# EAGLE schematic Select Fire Rapidstrike (EAGLE 9.1.0)

## Sheet 1 of 4
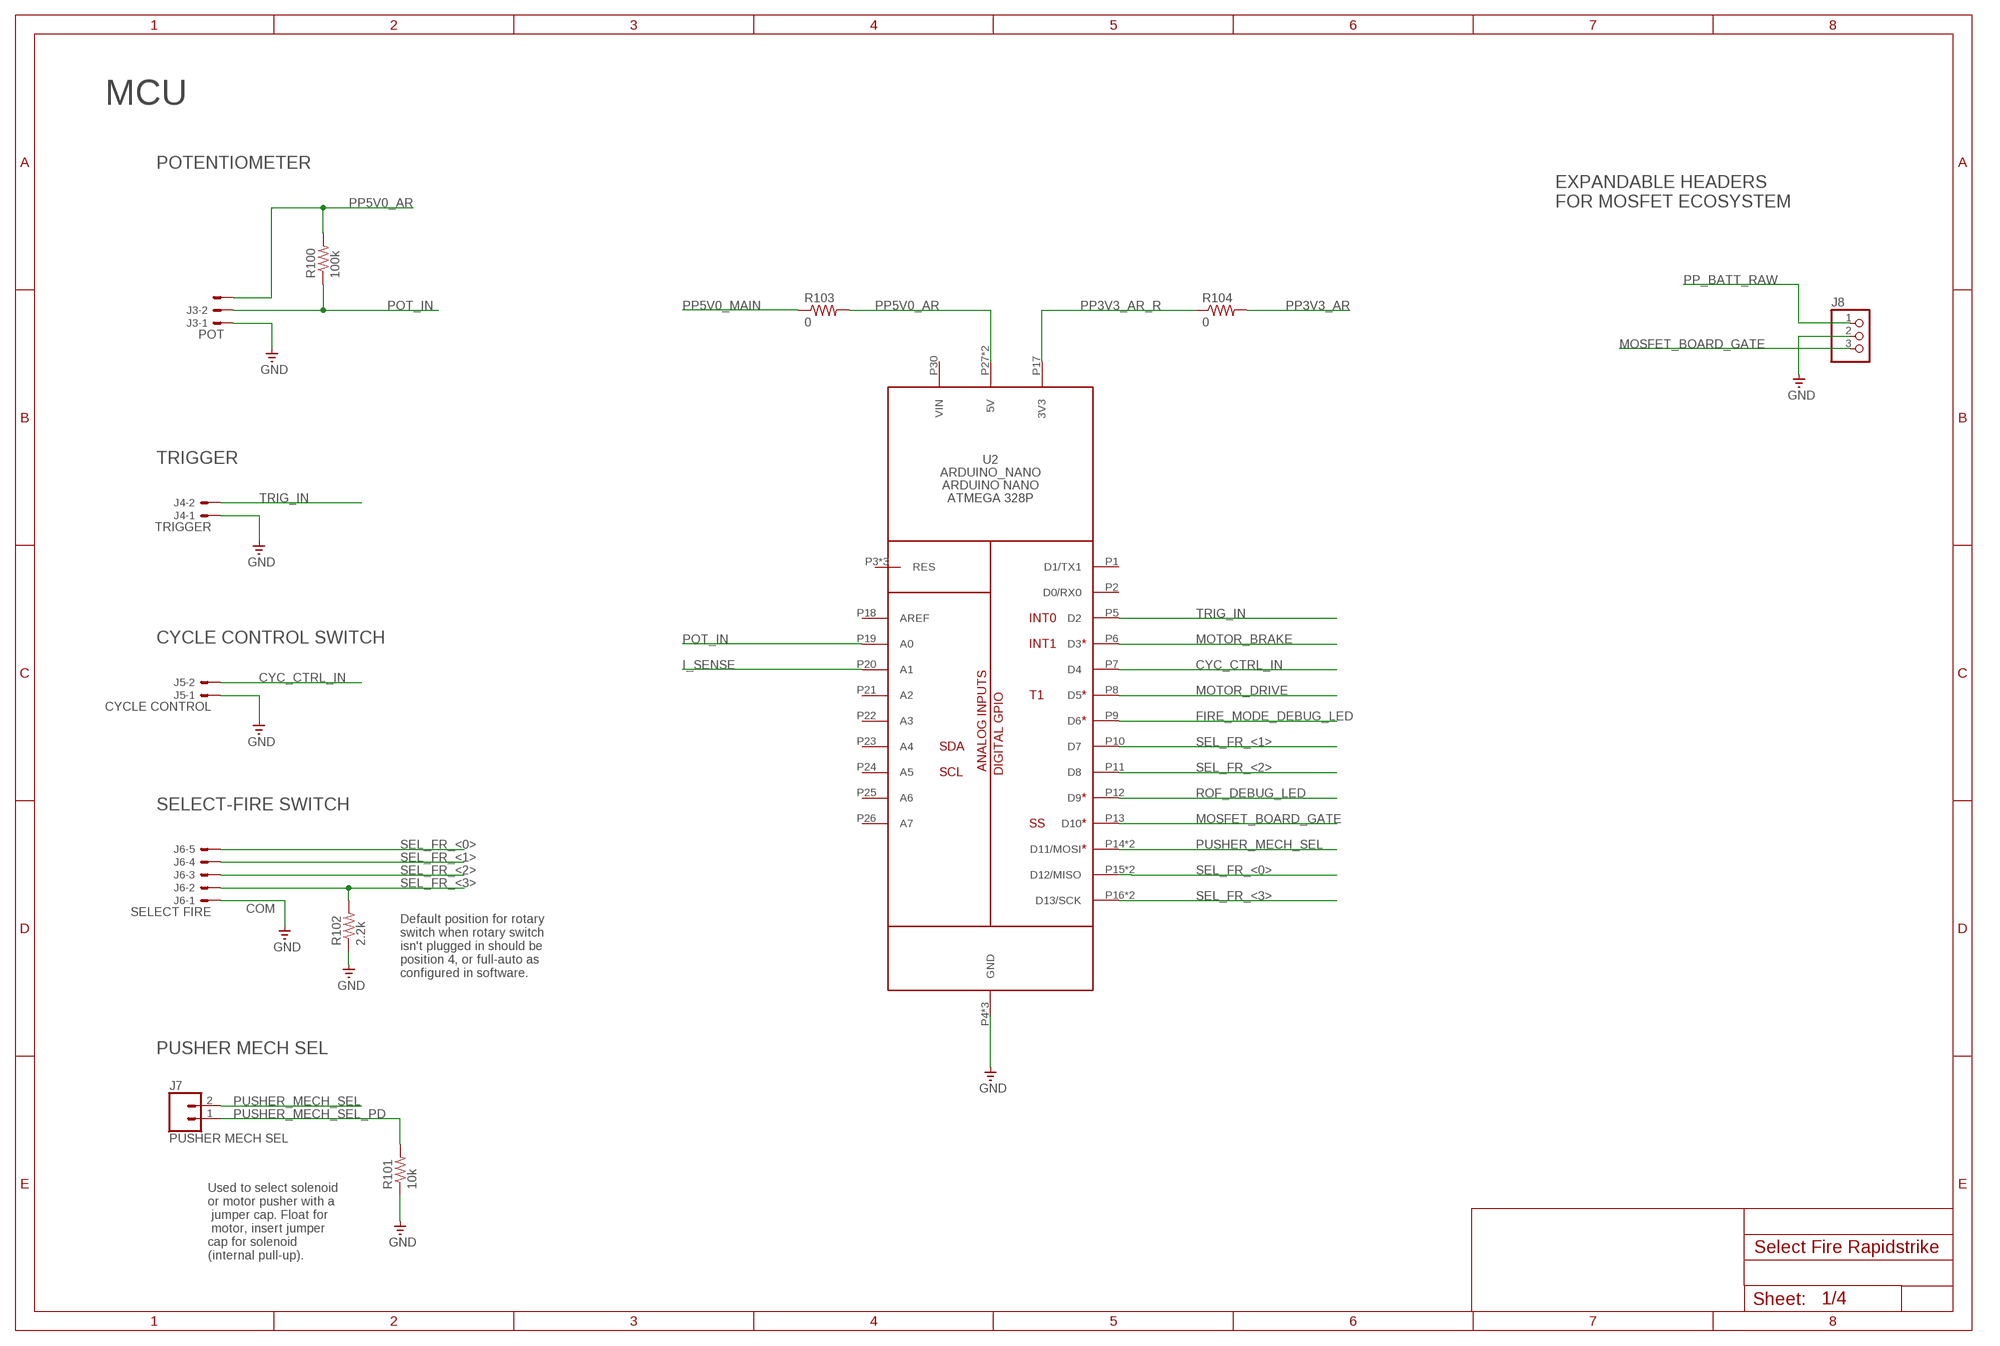
[diagram p0: schematic, sheet 1]

### Parts
J3  POT  JST-XH-03-PIN-LONG-PAD  [JST-XH-03-PACKAGE-LONG-PAD]
J4  TRIGGER  JST-XH-02-PIN-LONG-PAD  [JST-XH-02-PACKAGE-LONG-PAD]
J5  CYCLE CONTROL  JST-XH-02-PIN-LONG-PAD  [JST-XH-02-PACKAGE-LONG-PAD]
J6  SELECT FIRE  JST-XH-05-PIN-LONG-PAD  [JST-XH-05-PACKAGE-LONG-PAD]
J7  PUSHER MECH SEL  CONN_02  [1X02]
J8  PINHD-1X3  [1X03]
R100  100k  R-US_M0805  [M0805]
R101  10k  R-US_M0805  [M0805]
R102  2.2k  R-US_M0805  [M0805]
R103  0  R-US_M0805  [M0805]
R104  0  R-US_M0805  [M0805]
U2  ARDUINO_NANO  [ARDUINO_NANO]

### Nets
CYC_CTRL_IN: J5.2 U2.P7(D4) ; also sheet 4
FIRE_MODE_DEBUG_LED: U2.P9(D6) ; also sheet 4
GND: J3.1 J4.1 J5.1 J6.1 J8.2 R101.1 R102.1 U2.P4(GND) U2.P29(GND) U2.P32(GND) ; also sheet 2,3,4
I_SENSE: U2.P20(A1) ; also sheet 3
MOSFET_BOARD_GATE: J8.3 U2.P13(D10)
MOTOR_BRAKE: U2.P6(D3) ; also sheet 3,4
MOTOR_DRIVE: U2.P8(D5) ; also sheet 3,4
POT_IN: J3.2 R100.1 U2.P19(A0)
PP3V3_AR: R104.2 ; also sheet 2
PP3V3_AR_R: R104.1 U2.P17(3V3)
PP5V0_AR: J3.3 R100.2 R103.2 U2.P27(5V) U2.P36(5V) ; also sheet 2,4
PP5V0_MAIN: R103.1 ; also sheet 2
PP_BATT_RAW: J8.1 ; also sheet 2,3
PUSHER_MECH_SEL: J7.2 U2.P14(D11/MOSI) U2.P34(D11/MOSI)
PUSHER_MECH_SEL_PD: J7.1 R101.2
ROF_DEBUG_LED: U2.P12(D9) ; also sheet 4
SEL_FR_<0>: J6.5 U2.P15(D12/MISO) U2.P35(D12/MISO)
SEL_FR_<1>: J6.4 U2.P10(D7)
SEL_FR_<2>: J6.3 U2.P11(D8)
SEL_FR_<3>: J6.2 R102.2 U2.P16(D13/SCK) U2.P33(D13/SCK)
TRIG_IN: J4.2 U2.P5(D2) ; also sheet 4
Unconnected: U2.P1(D1/TX1) U2.P2(D0/RX0) U2.P3(RES) U2.P18(AREF) U2.P21(A2) U2.P22(A3) U2.P23(A4) U2.P24(A5) U2.P25(A6) U2.P26(A7) U2.P28(RES) U2.P30(VIN) U2.P31(RES)

### Notes on the sheet
- MCU
- POTENTIOMETER
- EXPANDABLE HEADERS 
  FOR MOSFET ECOSYSTEM
- TRIGGER
- CYCLE CONTROL SWITCH
- SELECT-FIRE SWITCH
- COM
- Default position for rotary
  switch when rotary switch 
  isn't plugged in should be 
  position 4, or full-auto as 
  configured in software.
- PUSHER MECH SEL
- Used to select solenoid 
  or motor pusher with a
   jumper cap. Float for
   motor, insert jumper 
  cap for solenoid 
  (internal pull-up).

## Sheet 2 of 4
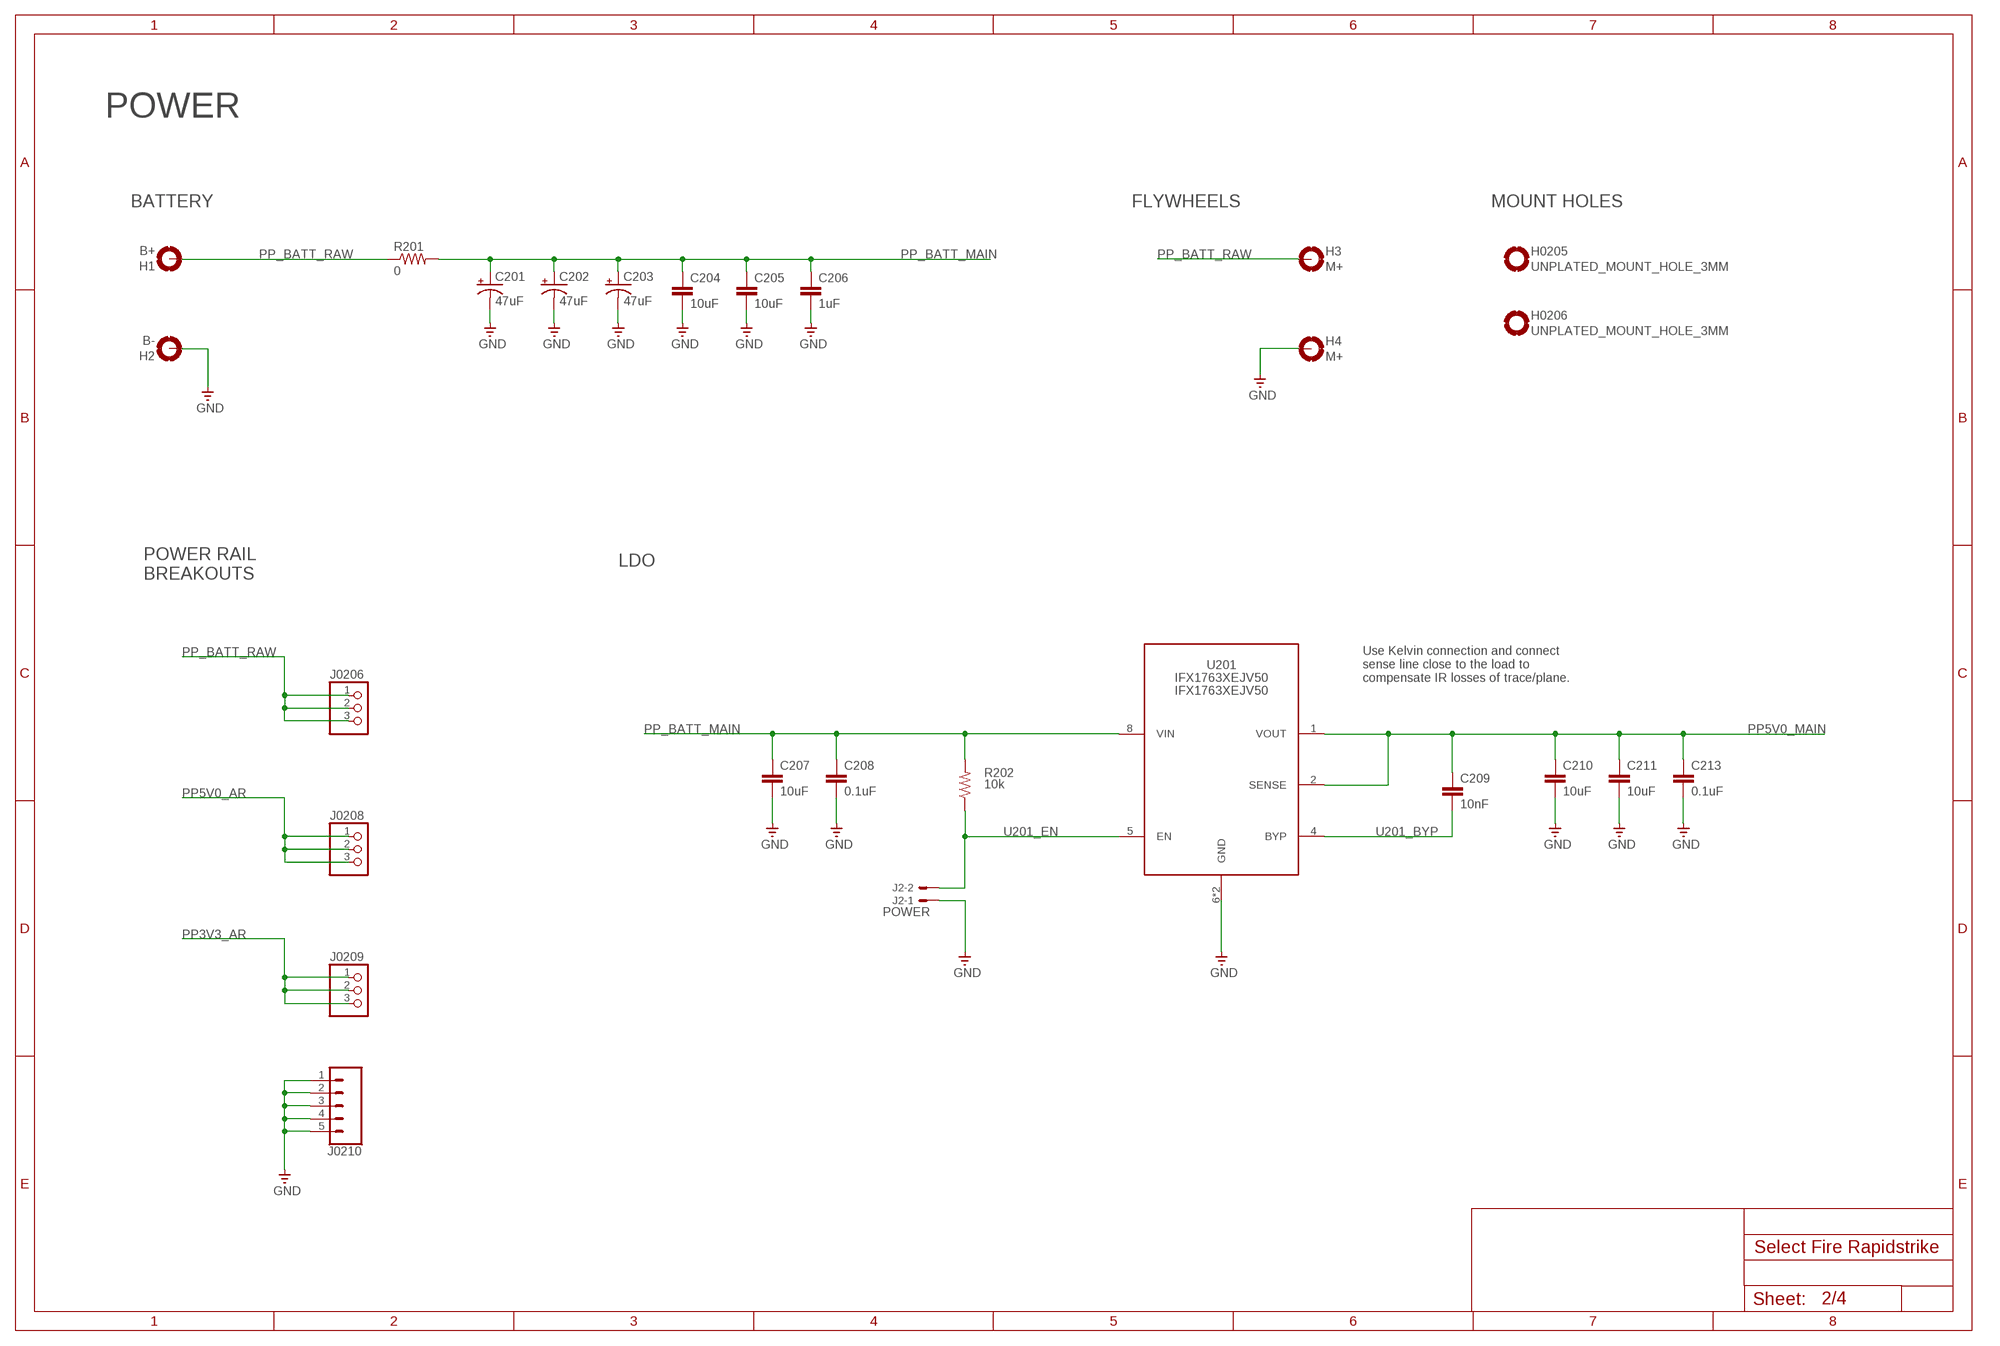
[diagram p1: schematic, sheet 2]

### Parts
C201  47uF  CPOL-USE2-5  [E2-5]
C202  47uF  CPOL-USE2-5  [E2-5]
C203  47uF  CPOL-USE2-5  [E2-5]
C204  10uF  CC1206  [C1206]
C205  10uF  CC1206  [C1206]
C206  1uF  C-EUC0805  [C0805]
C207  10uF  CC1206  [C1206]
C208  0.1uF  C-EUC0805  [C0805]
C209  10nF  C-EUC0805  [C0805]
C210  10uF  CC1206  [C1206]
C211  10uF  CC1206  [C1206]
C213  0.1uF  C-EUC0805  [C0805]
H1  B+  MOUNT-HOLE-2.5MM  [MOUNT-HOLE-2.5MM]
H2  B-  MOUNT-HOLE-2.5MM  [MOUNT-HOLE-2.5MM]
H3  M+  MOUNT-HOLE-2.5MM  [MOUNT-HOLE-2.5MM]
H4  M+  MOUNT-HOLE-2.5MM  [MOUNT-HOLE-2.5MM]
H0205  UNPLATED_MOUNT_HOLE_3MM  [UNPLATED_MOUNT_HOLE_3MM]
H0206  UNPLATED_MOUNT_HOLE_3MM  [UNPLATED_MOUNT_HOLE_3MM]
J2  POWER  JST-XH-02-PIN-LONG-PAD  [JST-XH-02-PACKAGE-LONG-PAD]
J0206  PINHD-1X3  [1X03]
J0208  PINHD-1X3  [1X03]
J0209  PINHD-1X3  [1X03]
J0210  CONN_05  [1X05]
R201  0  R-US_M0805  [M0805]
R202  10k  R-US_M0805  [M0805]
U201  IFX1763XEJV50  [PG-DSO-8]

### Nets
GND: C201.- C202.- C203.- C204.2 C205.2 C206.2 C207.2 C208.2 C210.2 C211.2 C213.2 H2.P$1(MOUNT) H4.P$1(MOUNT) J2.1 J0210.1 J0210.2 J0210.3 J0210.4 J0210.5 U201.6(GND) U201.BODY(GND) ; also sheet 1,3,4
PP3V3_AR: J0209.1 J0209.2 J0209.3 ; also sheet 1
PP5V0_AR: J0208.1 J0208.2 J0208.3 ; also sheet 1,4
PP5V0_MAIN: C209.1 C210.1 C211.1 C213.1 U201.1(VOUT) U201.2(SENSE) ; also sheet 1
PP_BATT_MAIN [BATT_POWER]: C201.+ C202.+ C203.+ C204.1 C205.1 C206.1 C207.1 C208.1 R201.2 R202.2 U201.8(VIN)
PP_BATT_RAW: H1.P$1(MOUNT) H3.P$1(MOUNT) J0206.1 J0206.2 J0206.3 R201.1 ; also sheet 1,3
U201_BYP: C209.2 U201.4(BYP)
U201_EN: J2.2 R202.1 U201.5(EN)

### Notes on the sheet
- POWER
- BATTERY | FLYWHEELS | MOUNT HOLES
- LDO
- POWER RAIL
  BREAKOUTS
- Use Kelvin connection and connect
  sense line close to the load to 
  compensate IR losses of trace/plane.

## Sheet 3 of 4
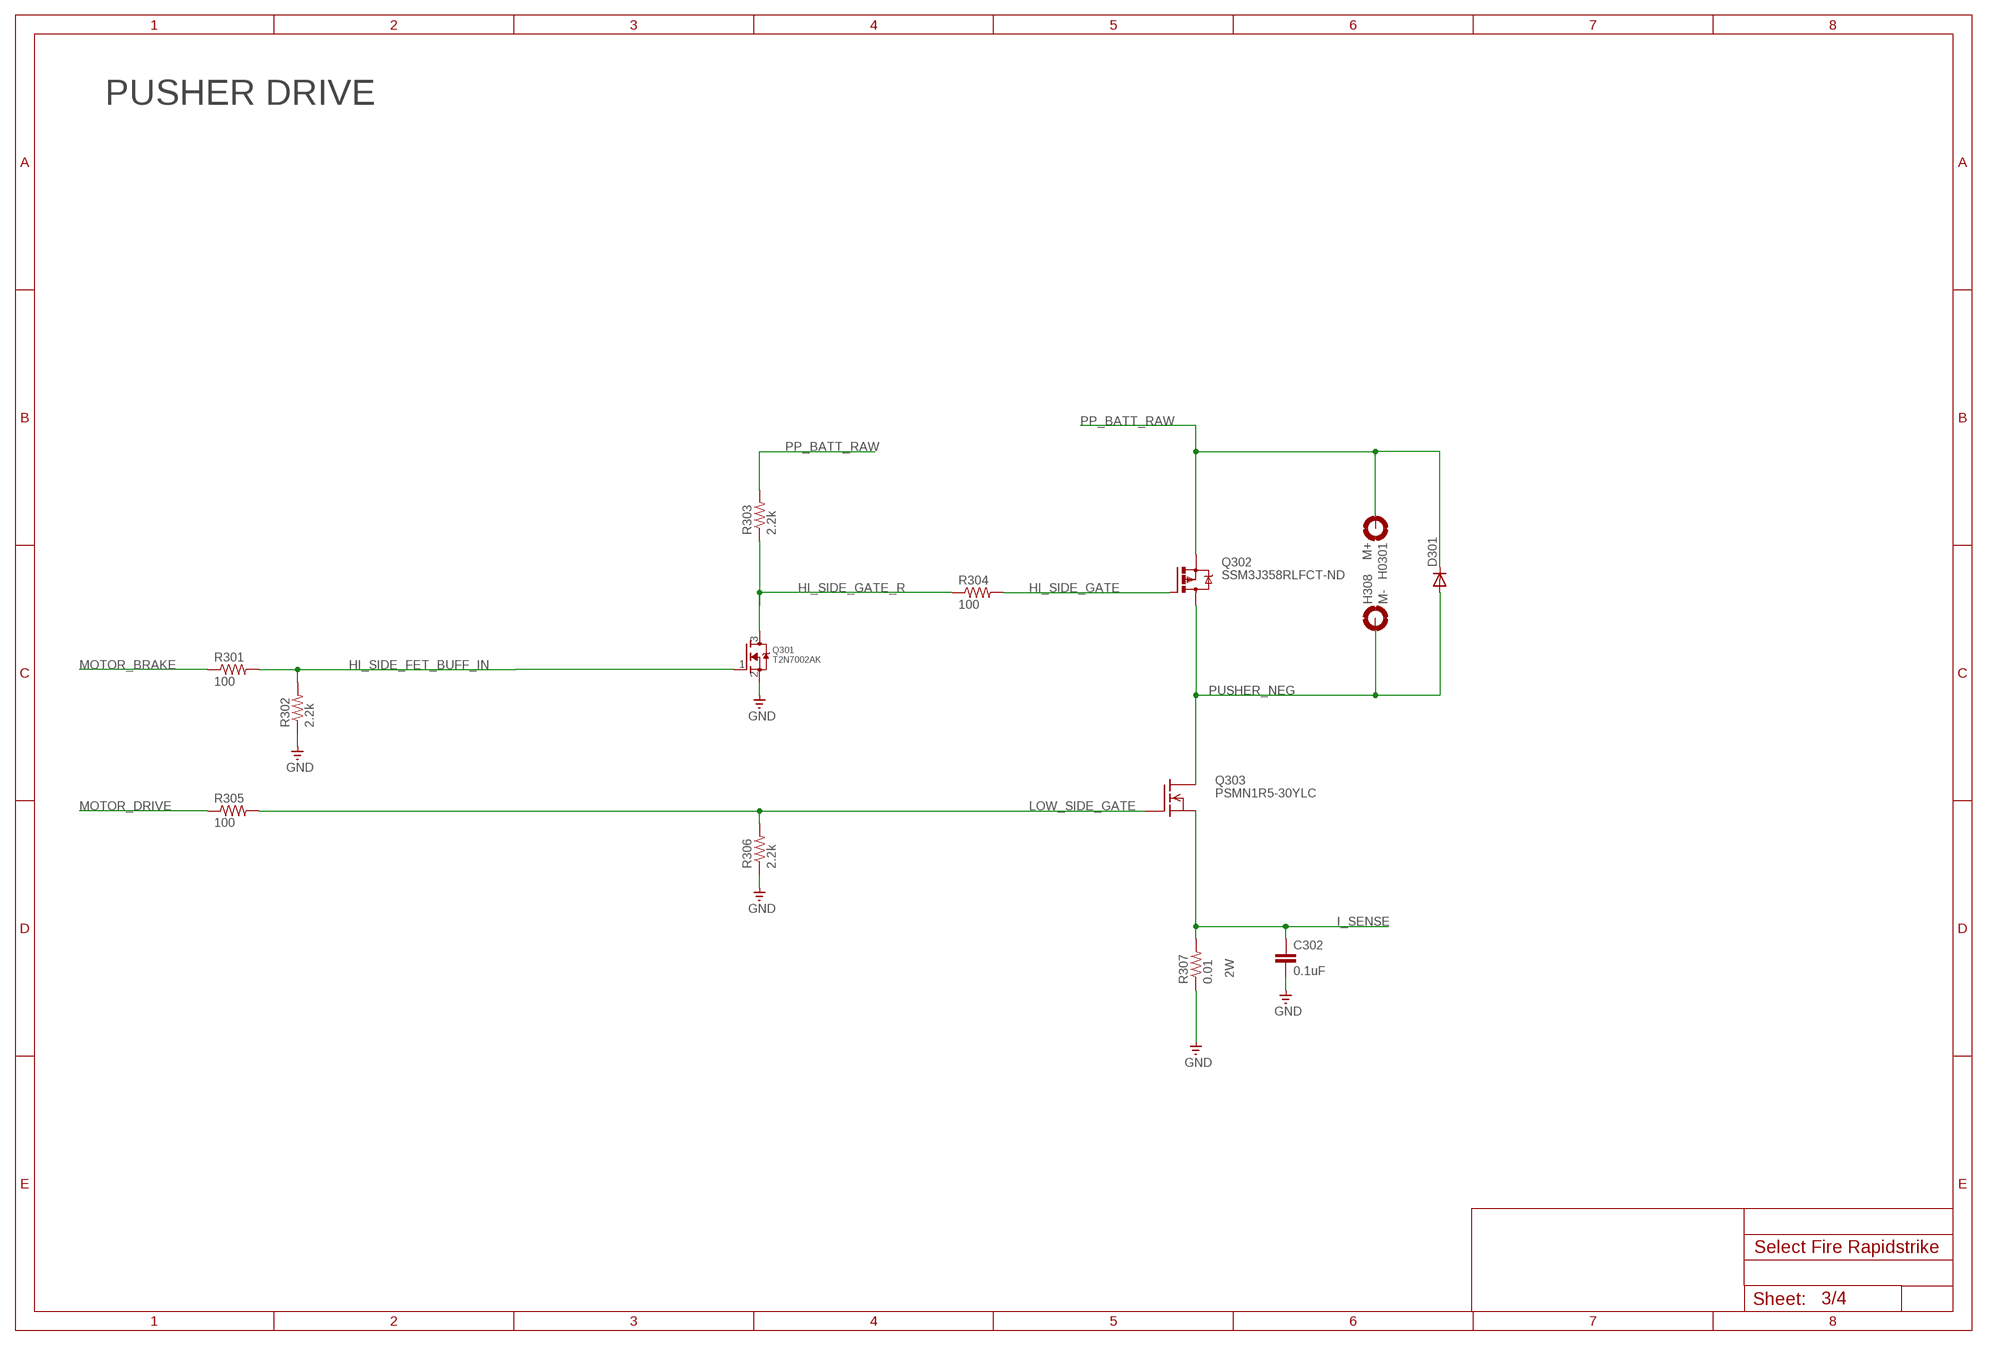
[diagram p2: schematic, sheet 3]

### Parts
C302  0.1uF  C-EUC0805  [C0805]
D301  S2A  [DO214AA]
H0301  M+  MOUNT-HOLE-2.5MM  [MOUNT-HOLE-2.5MM]
H308  M-  MOUNT-HOLE-2.5MM  [MOUNT-HOLE-2.5MM]
Q301  T2N7002AK  MOSFET-NREFLOW  [SOT23]
Q302  SSM3J358RLFCT-ND  MOSFET-P-SOT23  [SOT-23]
Q303  PSMN1R5-30YLC  [TO127P600X120-5N]
R301  100  R-US_M0805  [M0805]
R302  2.2k  R-US_M0805  [M0805]
R303  2.2k  R-US_M0805  [M0805]
R304  100  R-US_M0805  [M0805]
R305  100  R-US_M0805  [M0805]
R306  2.2k  R-US_M0805  [M0805]
R307  0.01  R-US_R2512  [R2512]

### Nets
GND: C302.2 Q301.2(S) R302.1 R306.1 R307.1 ; also sheet 1,2,4
HI_SIDE_FET_BUFF_IN: Q301.1(G) R301.2 R302.2
HI_SIDE_GATE: Q302.1(G) R304.2
HI_SIDE_GATE_R: Q301.3(D) R303.1 R304.1
I_SENSE: C302.1 Q303.1(S) Q303.2(S) Q303.3(S) R307.2 ; also sheet 1
LOW_SIDE_GATE: Q303.4(G) R305.2 R306.2
MOTOR_BRAKE: R301.1 ; also sheet 1,4
MOTOR_DRIVE: R305.1 ; also sheet 1,4
PP_BATT_RAW: D301.C H0301.P$1(MOUNT) Q302.2(S) R303.2 ; also sheet 1,2
PUSHER_NEG: D301.A H308.P$1(MOUNT) Q302.3(D) Q303.5(D)

### Notes on the sheet
- PUSHER DRIVE

## Sheet 4 of 4
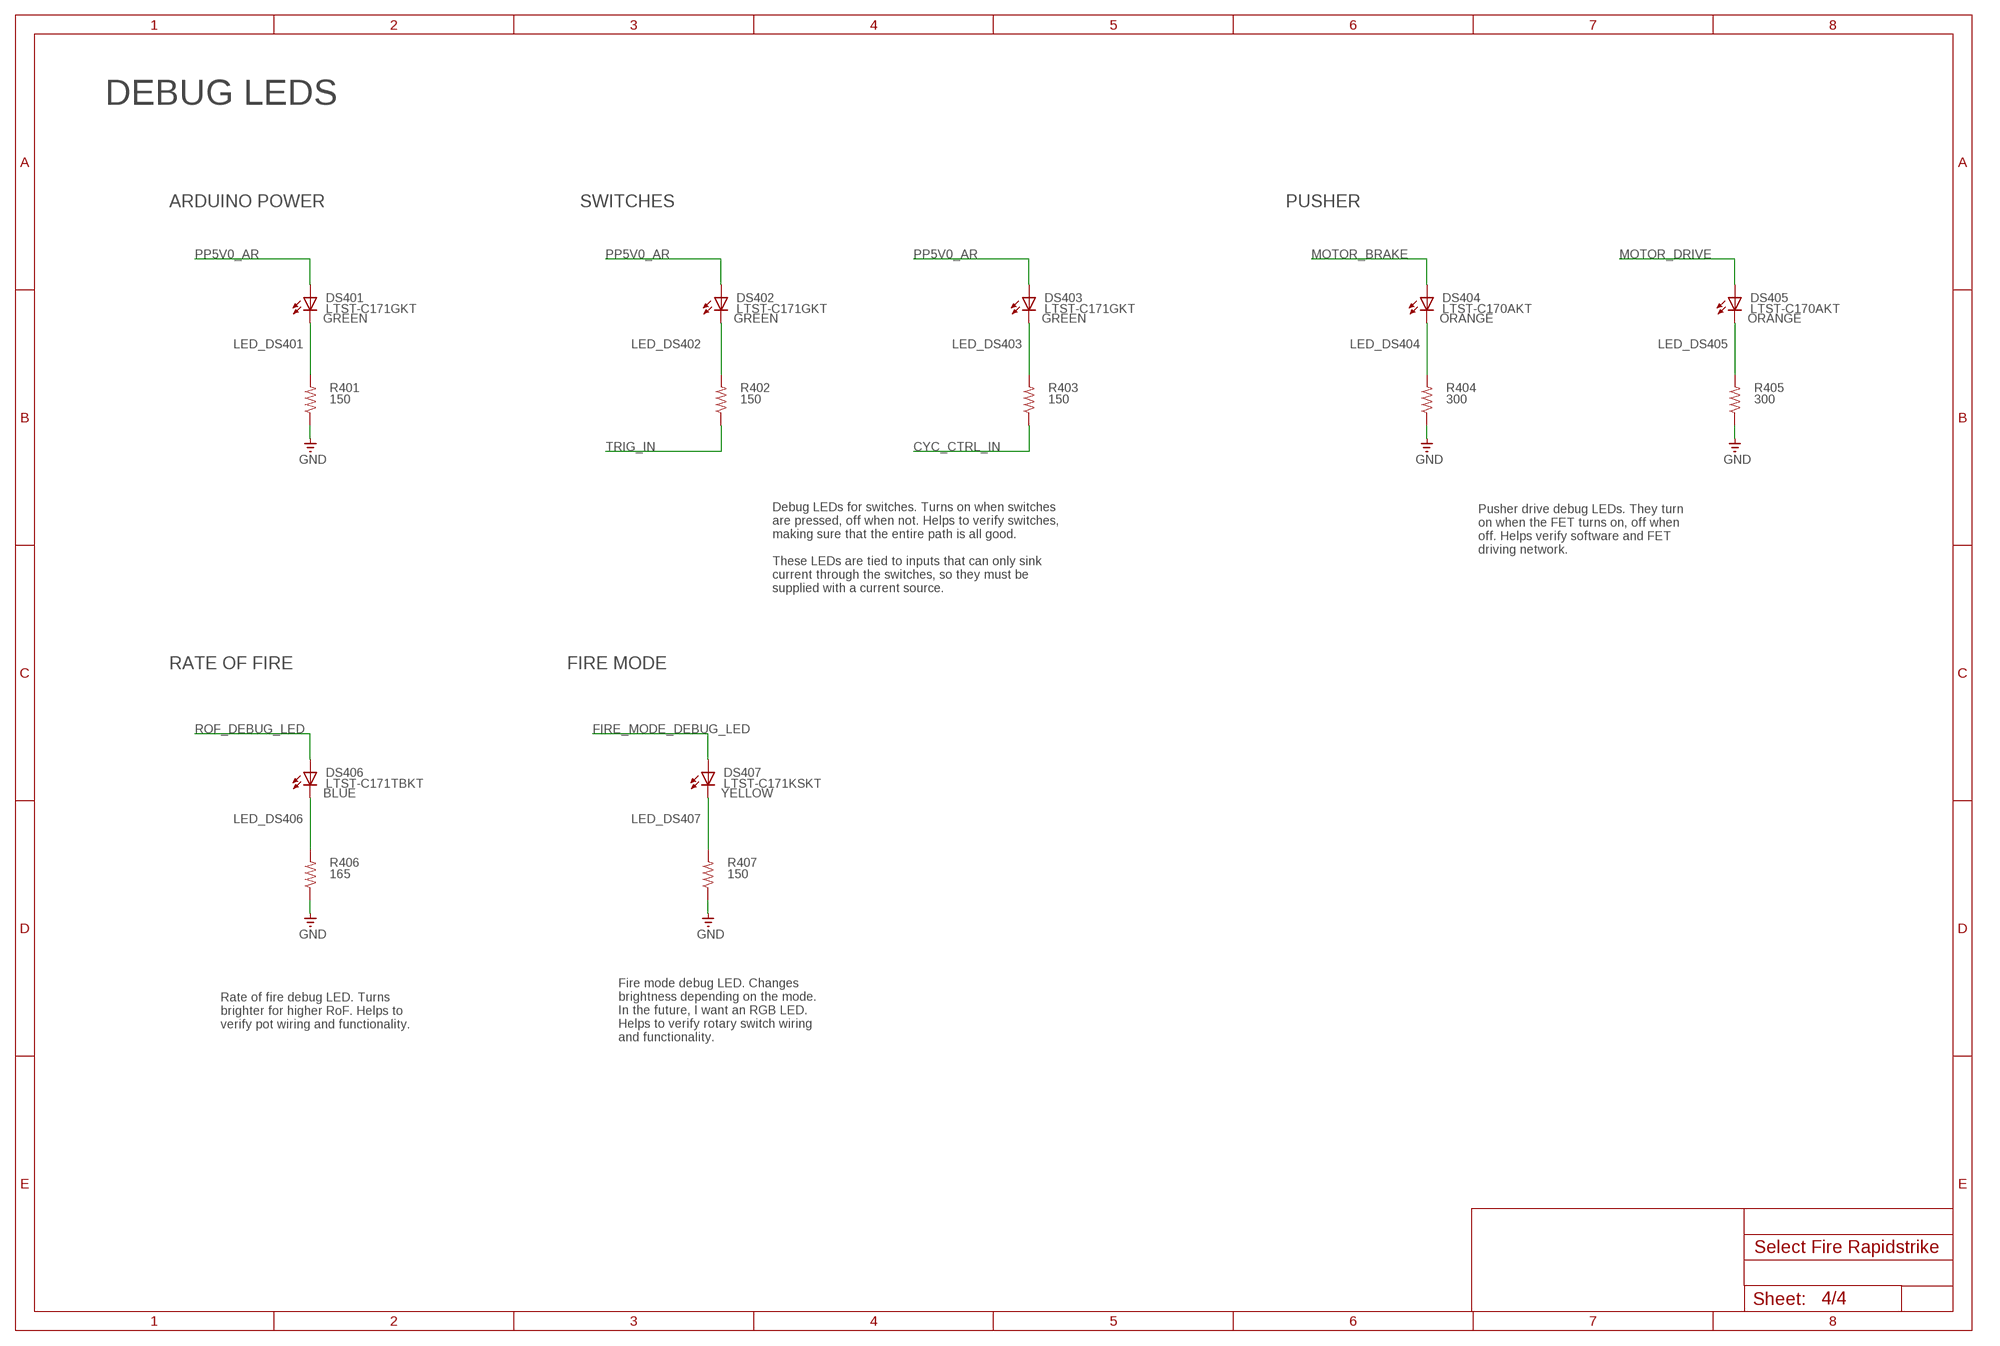
[diagram p3: schematic, sheet 4]

### Parts
DS401  LTST-C171GKT  LEDCHIPLED_0805  [CHIPLED_0805]
DS402  LTST-C171GKT  LEDCHIPLED_0805  [CHIPLED_0805]
DS403  LTST-C171GKT  LEDCHIPLED_0805  [CHIPLED_0805]
DS404  LTST-C170AKT  LEDCHIPLED_0805  [CHIPLED_0805]
DS405  LTST-C170AKT  LEDCHIPLED_0805  [CHIPLED_0805]
DS406  LTST-C171TBKT  LEDCHIPLED_0805  [CHIPLED_0805]
DS407  LTST-C171KSKT  LEDCHIPLED_0805  [CHIPLED_0805]
R401  150  R-US_M0805  [M0805]
R402  150  R-US_M0805  [M0805]
R403  150  R-US_M0805  [M0805]
R404  300  R-US_M0805  [M0805]
R405  300  R-US_M0805  [M0805]
R406  165  R-US_M0805  [M0805]
R407  150  R-US_M0805  [M0805]

### Nets
CYC_CTRL_IN: R403.1 ; also sheet 1
FIRE_MODE_DEBUG_LED: DS407.A ; also sheet 1
GND: R401.1 R404.1 R405.1 R406.1 R407.1 ; also sheet 1,2,3
LED_DS401: DS401.C R401.2
LED_DS402: DS402.C R402.2
LED_DS403: DS403.C R403.2
LED_DS404: DS404.C R404.2
LED_DS405: DS405.C R405.2
LED_DS406: DS406.C R406.2
LED_DS407: DS407.C R407.2
MOTOR_BRAKE: DS404.A ; also sheet 1,3
MOTOR_DRIVE: DS405.A ; also sheet 1,3
PP5V0_AR: DS401.A DS402.A DS403.A ; also sheet 1,2
ROF_DEBUG_LED: DS406.A ; also sheet 1
TRIG_IN: R402.1 ; also sheet 1

### Notes on the sheet
- DEBUG LEDS
- ARDUINO POWER | SWITCHES | PUSHER
- Pusher drive debug LEDs. They turn
  on when the FET turns on, off when 
  off. Helps verify software and FET 
  driving network.
- Debug LEDs for switches. Turns on when switches 
  are pressed, off when not. Helps to verify switches, 
  making sure that the entire path is all good. 
  
  These LEDs are tied to inputs that can only sink 
  current through the switches, so they must be 
  supplied with a current source.
- RATE OF FIRE | FIRE MODE
- Rate of fire debug LED. Turns 
  brighter for higher RoF. Helps to 
  verify pot wiring and functionality.
- Fire mode debug LED. Changes 
  brightness depending on the mode.
  In the future, I want an RGB LED.
  Helps to verify rotary switch wiring 
  and functionality.

## Library data of the parts
C201-C203 = adafruit:CPOL-US: POLARIZED CAPACITOR, American symbol
C204 C205 C207 C210 C211 = eagle-ltspice:C: CAPACITOR, European symbol; SPICEMODEL: NONE; SPICEPREFIX: C
C206 C208 C209 C213 C302 = rcl:C-EU: CAPACITOR, European symbol; SPICEPREFIX: C
D301 = s2x_10:S2*: S2A - S2M General Purpose Rectifiers Source: http://www.fairchildsemi.com/datasheets/S2/S2A.pdf; MF: Fairchild; MPN: S2A; OC_FARNELL: 1467485; OC_NEWARK: 58K2391
DS401-DS403 = adafruit:LED: LED OSRAM: - CHIPLED LG R971, LG N971, LY N971, LG Q971, LY Q971, LO R971, LY R971 LH N974, LH R974 LS Q976, LO Q976, LY Q976 LO Q996 - Hyper CHIPLED LW Q18S LB Q993, LB Q99A, LB R99A - SideLED LS A670, LO A670, LY A670, LG A670, LP A670 LB A673, LV A673, LT A673, LW A673 LH A674 LY A675 LS A676, LA A676, LO A676, LY A676, LW A676 LS A679, LY A679, LG A679 - Hyper Micro SIDELED® LS Y876, LA Y876, LO Y876, LY Y876 LT Y87S - SmartLED LW L88C, LW L88S LB L89C, LB L89S, LG L890 LS L89K, LO L89K, LY L89K LS L896, LA L896, LO L896, LY L896 - TOPLED LS T670, LO T670, LY T670, LG T670, LP T670 LSG T670, LSP T670, LSY T670, LOP T670, LYG T670 LG T671, LOG T671, LSG T671 LB T673, LV T673, LT T673, LW T673 LH T674 LS T676, LA T676, LO T676, LY T676, LB T676, LH T676, LSB T676, LW T676 LB T67C, LV T67C, LT T67C, LS T67K, LO T67K, LY T67K, LW E67C LS E67B, LA E67B, LO E67B, LY E67B, LB E67C, LV E67C, LT E67C LW T67C LS T679, LY T679, LG T679 LS T770, LO T770, LY T770, LG T770, LP T770 LB T773, LV T773, LT T773, LW T773 LH T774 LS E675, LA E675, LY E675, LS T675 LS T776, LA T776, LO T776, LY T776, LB T776 LHGB T686 LT T68C, LB T68C - Hyper Mini TOPLED® LB M676 - Mini TOPLED Santana® LG M470 LS M47K, LO M47K, LY M47K Source: http://www.osram.convergy.de/; COLOR: GREEN
DS404 DS405 = adafruit:LED: LED OSRAM: - CHIPLED LG R971, LG N971, LY N971, LG Q971, LY Q971, LO R971, LY R971 LH N974, LH R974 LS Q976, LO Q976, LY Q976 LO Q996 - Hyper CHIPLED LW Q18S LB Q993, LB Q99A, LB R99A - SideLED LS A670, LO A670, LY A670, LG A670, LP A670 LB A673, LV A673, LT A673, LW A673 LH A674 LY A675 LS A676, LA A676, LO A676, LY A676, LW A676 LS A679, LY A679, LG A679 - Hyper Micro SIDELED® LS Y876, LA Y876, LO Y876, LY Y876 LT Y87S - SmartLED LW L88C, LW L88S LB L89C, LB L89S, LG L890 LS L89K, LO L89K, LY L89K LS L896, LA L896, LO L896, LY L896 - TOPLED LS T670, LO T670, LY T670, LG T670, LP T670 LSG T670, LSP T670, LSY T670, LOP T670, LYG T670 LG T671, LOG T671, LSG T671 LB T673, LV T673, LT T673, LW T673 LH T674 LS T676, LA T676, LO T676, LY T676, LB T676, LH T676, LSB T676, LW T676 LB T67C, LV T67C, LT T67C, LS T67K, LO T67K, LY T67K, LW E67C LS E67B, LA E67B, LO E67B, LY E67B, LB E67C, LV E67C, LT E67C LW T67C LS T679, LY T679, LG T679 LS T770, LO T770, LY T770, LG T770, LP T770 LB T773, LV T773, LT T773, LW T773 LH T774 LS E675, LA E675, LY E675, LS T675 LS T776, LA T776, LO T776, LY T776, LB T776 LHGB T686 LT T68C, LB T68C - Hyper Mini TOPLED® LB M676 - Mini TOPLED Santana® LG M470 LS M47K, LO M47K, LY M47K Source: http://www.osram.convergy.de/; COLOR: ORANGE
DS406 = adafruit:LED: LED OSRAM: - CHIPLED LG R971, LG N971, LY N971, LG Q971, LY Q971, LO R971, LY R971 LH N974, LH R974 LS Q976, LO Q976, LY Q976 LO Q996 - Hyper CHIPLED LW Q18S LB Q993, LB Q99A, LB R99A - SideLED LS A670, LO A670, LY A670, LG A670, LP A670 LB A673, LV A673, LT A673, LW A673 LH A674 LY A675 LS A676, LA A676, LO A676, LY A676, LW A676 LS A679, LY A679, LG A679 - Hyper Micro SIDELED® LS Y876, LA Y876, LO Y876, LY Y876 LT Y87S - SmartLED LW L88C, LW L88S LB L89C, LB L89S, LG L890 LS L89K, LO L89K, LY L89K LS L896, LA L896, LO L896, LY L896 - TOPLED LS T670, LO T670, LY T670, LG T670, LP T670 LSG T670, LSP T670, LSY T670, LOP T670, LYG T670 LG T671, LOG T671, LSG T671 LB T673, LV T673, LT T673, LW T673 LH T674 LS T676, LA T676, LO T676, LY T676, LB T676, LH T676, LSB T676, LW T676 LB T67C, LV T67C, LT T67C, LS T67K, LO T67K, LY T67K, LW E67C LS E67B, LA E67B, LO E67B, LY E67B, LB E67C, LV E67C, LT E67C LW T67C LS T679, LY T679, LG T679 LS T770, LO T770, LY T770, LG T770, LP T770 LB T773, LV T773, LT T773, LW T773 LH T774 LS E675, LA E675, LY E675, LS T675 LS T776, LA T776, LO T776, LY T776, LB T776 LHGB T686 LT T68C, LB T68C - Hyper Mini TOPLED® LB M676 - Mini TOPLED Santana® LG M470 LS M47K, LO M47K, LY M47K Source: http://www.osram.convergy.de/; COLOR: BLUE
DS407 = adafruit:LED: LED OSRAM: - CHIPLED LG R971, LG N971, LY N971, LG Q971, LY Q971, LO R971, LY R971 LH N974, LH R974 LS Q976, LO Q976, LY Q976 LO Q996 - Hyper CHIPLED LW Q18S LB Q993, LB Q99A, LB R99A - SideLED LS A670, LO A670, LY A670, LG A670, LP A670 LB A673, LV A673, LT A673, LW A673 LH A674 LY A675 LS A676, LA A676, LO A676, LY A676, LW A676 LS A679, LY A679, LG A679 - Hyper Micro SIDELED® LS Y876, LA Y876, LO Y876, LY Y876 LT Y87S - SmartLED LW L88C, LW L88S LB L89C, LB L89S, LG L890 LS L89K, LO L89K, LY L89K LS L896, LA L896, LO L896, LY L896 - TOPLED LS T670, LO T670, LY T670, LG T670, LP T670 LSG T670, LSP T670, LSY T670, LOP T670, LYG T670 LG T671, LOG T671, LSG T671 LB T673, LV T673, LT T673, LW T673 LH T674 LS T676, LA T676, LO T676, LY T676, LB T676, LH T676, LSB T676, LW T676 LB T67C, LV T67C, LT T67C, LS T67K, LO T67K, LY T67K, LW E67C LS E67B, LA E67B, LO E67B, LY E67B, LB E67C, LV E67C, LT E67C LW T67C LS T679, LY T679, LG T679 LS T770, LO T770, LY T770, LG T770, LP T770 LB T773, LV T773, LT T773, LW T773 LH T774 LS E675, LA E675, LY E675, LS T675 LS T776, LA T776, LO T776, LY T776, LB T776 LHGB T686 LT T68C, LB T68C - Hyper Mini TOPLED® LB M676 - Mini TOPLED Santana® LG M470 LS M47K, LO M47K, LY M47K Source: http://www.osram.convergy.de/; COLOR: YELLOW
H1-H4 H0301 H308 = my-eagle-lib:MOUNT-HOLE-2.5MM: Mount hole, 2.5mm inner diameter. Fits 14awg wiring great, 16awg a bit tight. Used in MOSFET board kit v1.2.
H0205 H0206 = my-eagle-lib:UNPLATED_MOUNT_HOLE_3MM: Unplated mount hole for Nerf Screws with 3mm (118.11 mill) diameter. Good if used near components that will be hand soldered so solder can't get on hole's copper plating
J2 J4 J5 = Rembrandt Electronics - JST XH Connectors v1-0:JST-XH-02-PIN: JST XH Connector 2 Pin Wire to board connector. Pitch: 2,54 mm, (0.100") Number of pins: 2 Created by Rembrandt Electronics www.rembrandtelectronics.com
J3 = Rembrandt Electronics - JST XH Connectors v1-0:JST-XH-03-PIN: JST XH Connector 2 Pin Wire to board connector. Pitch: 2,54 mm, (0.100") Number of pins: 3 Created by Rembrandt Electronics www.rembrandtelectronics.com
J6 = Rembrandt Electronics - JST XH Connectors v1-0:JST-XH-05-PIN: JST XH Connector 2 Pin Wire to board connector. Pitch: 2,54 mm, (0.100") Number of pins: 5 Created by Rembrandt Electronics www.rembrandtelectronics.com
J7 = SparkFun-Connectors:CONN_02: Multi connection point. Often used as Generic Header-pin footprint for 0.1 inch spaced/style header connections On any of the 0.1 inch spaced packages, you can populate with these: Break Away Headers - Straight <https://www.sparkfun.com/products/116> (PRT-00116) Break Away Male Headers - Right Angle <https://www.sparkfun.com/products/553> (PRT-00553) Female Headers <https://www.sparkfun.com/products/115> (PRT-00115) Break Away Headers - Machine Pin <https://www.sparkfun.com/products/117> (PRT-00117) Break Away Female Headers - Swiss Machine Pin <https://www.sparkfun.com/products/743> (PRT-00743) For SCREWTERMINALS and SPRING TERMINALS visit here: Screw Terimnals on SparkFun.com <https://www.sparkfun.com/search/results?term=Screw+Terminals> (5mm/3.5mm/2.54mm spacing) This device is also useful as a general connection point to wire up your design to another part of your project. Our various solder wires solder well into these plated through hole pads. Hook-Up Wire - Assortment (Stranded, 22 AWG) <https://www.sparkfun.com/products/11375> (PRT-11375) Hook-Up Wire - Assortment (Solid Core, 22 AWG) <https://www.sparkfun.com/products/11367> (PRT-11367) View the entire wire category on our website here <https://www.sparkfun.com/categories/141> Special notes: Molex polarized connector foot print use with: PRT-08233 with associated crimp pins and housings. 2.54_SCREWTERM for use with PRT-10571. 3.5mm Screw Terminal footprints for PRT-08084 5mm Screw Terminal footprints for use with PRT-08432
J8 J0206 J0208 J0209 = adafruit:PINHD-1X3: PIN HEADER
J0210 = SparkFun-Connectors:CONN_05: Multi connection point. Often used as Generic Header-pin footprint for 0.1 inch spaced/style header connections On any of the 0.1 inch spaced packages, you can populate with these: Break Away Headers - Straight <https://www.sparkfun.com/products/116> (PRT-00116) Break Away Male Headers - Right Angle <https://www.sparkfun.com/products/553> (PRT-00553) Female Headers <https://www.sparkfun.com/products/115> (PRT-00115) Break Away Headers - Machine Pin <https://www.sparkfun.com/products/117> (PRT-00117) Break Away Female Headers - Swiss Machine Pin <https://www.sparkfun.com/products/743> (PRT-00743) For SCREWTERMINALS and SPRING TERMINALS visit here: Screw Terimnals on SparkFun.com <https://www.sparkfun.com/search/results?term=Screw+Terminals> (5mm/3.5mm/2.54mm spacing) This device is also useful as a general connection point to wire up your design to another part of your project. Our various solder wires solder well into these plated through hole pads. Hook-Up Wire - Assortment (Stranded, 22 AWG) <https://www.sparkfun.com/products/11375> (PRT-11375) Hook-Up Wire - Assortment (Solid Core, 22 AWG) <https://www.sparkfun.com/products/11367> (PRT-11367) View the entire wire category on our website here <https://www.sparkfun.com/categories/141> Special notes: Molex polarized connector foot print use with SKU : PRT-08231 with associated crimp pins and housings. 1MM SMD Version SKU: PRT-10208
Q301 = adafruit:MOSFET-N: N-Channel Mosfet 2N7002E - 60V 260mA SOT23 [Digikey: 2N7002ET1GOSTR-ND] - REEL BSH103 - 30V 850mA SOT23 [Digikey: 568-5013-1-ND]
Q302 = bt_transistor:MOSFET-P: P-Channel MOSFET with integrated body diode
Q303 = my-eagle-lib:PSMN1R5-30YLC: PSMN1R5-30YLC N-Channel Power MOSFET 30V, 100A, 1.55mΩ logic level MOSFET, surface-mount SOT669 package Datasheet <https://assets.nexperia.com/documents/data-sheet/PSMN1R5-30YLC.pdf> DigiKey Buy Link <https://www.digikey.com/product-detail/en/nexperia-usa-inc/PSMN1R5-30YLC115/1727-5297-1-ND/2674291> Package stolen from here <https://www.mikrocontroller.net/topic/236049> Symbol stolen from here <https://github.com/adafruit/Adafruit-Eagle-Library>
R100-R104 R301-R306 R401-R407 = adafruit:R-US_: RESISTOR, American symbol
R201 R202 = adafruit:R-US_: RESISTOR, American symbol; STUFF: NO STUFF
R307 = adafruit:R-US_: RESISTOR, American symbol; POWER: 2W
U2 = my-eagle-lib:ARDUINO_NANO
U201 = my-eagle-lib:IFX1763XEJV50: IFX1763XEJV50 The IFX1763 V50 is a micropower, low noise, low dropout 5 V voltage regulator. The device is capable of supplying an output current of 500 mA with a dropout voltage of 350 mV. Designed for use in battery-powered systems, the low quiescent current of 30 µA makes it an ideal choice. This is the SOIC-8 with body pad (PG-DSO-8 Exposed Pad) package variant Datasheet: https://www.infineon.com/dgdl/Infineon-IFX1763_V50-DS-v01_11-EN.pdf?fileId=5546d4624bbf60fb014bcaa8e8c04f28

## Net classes
1 BATT_POWER: width 0.254 mm